# Altium schematic sheet OSCILLAR_HFB_V1p0_CAL.SchDoc
size A4; SheetNumber: 9; SheetTotal: 11; Title_: Aux Gain Stabilization Block
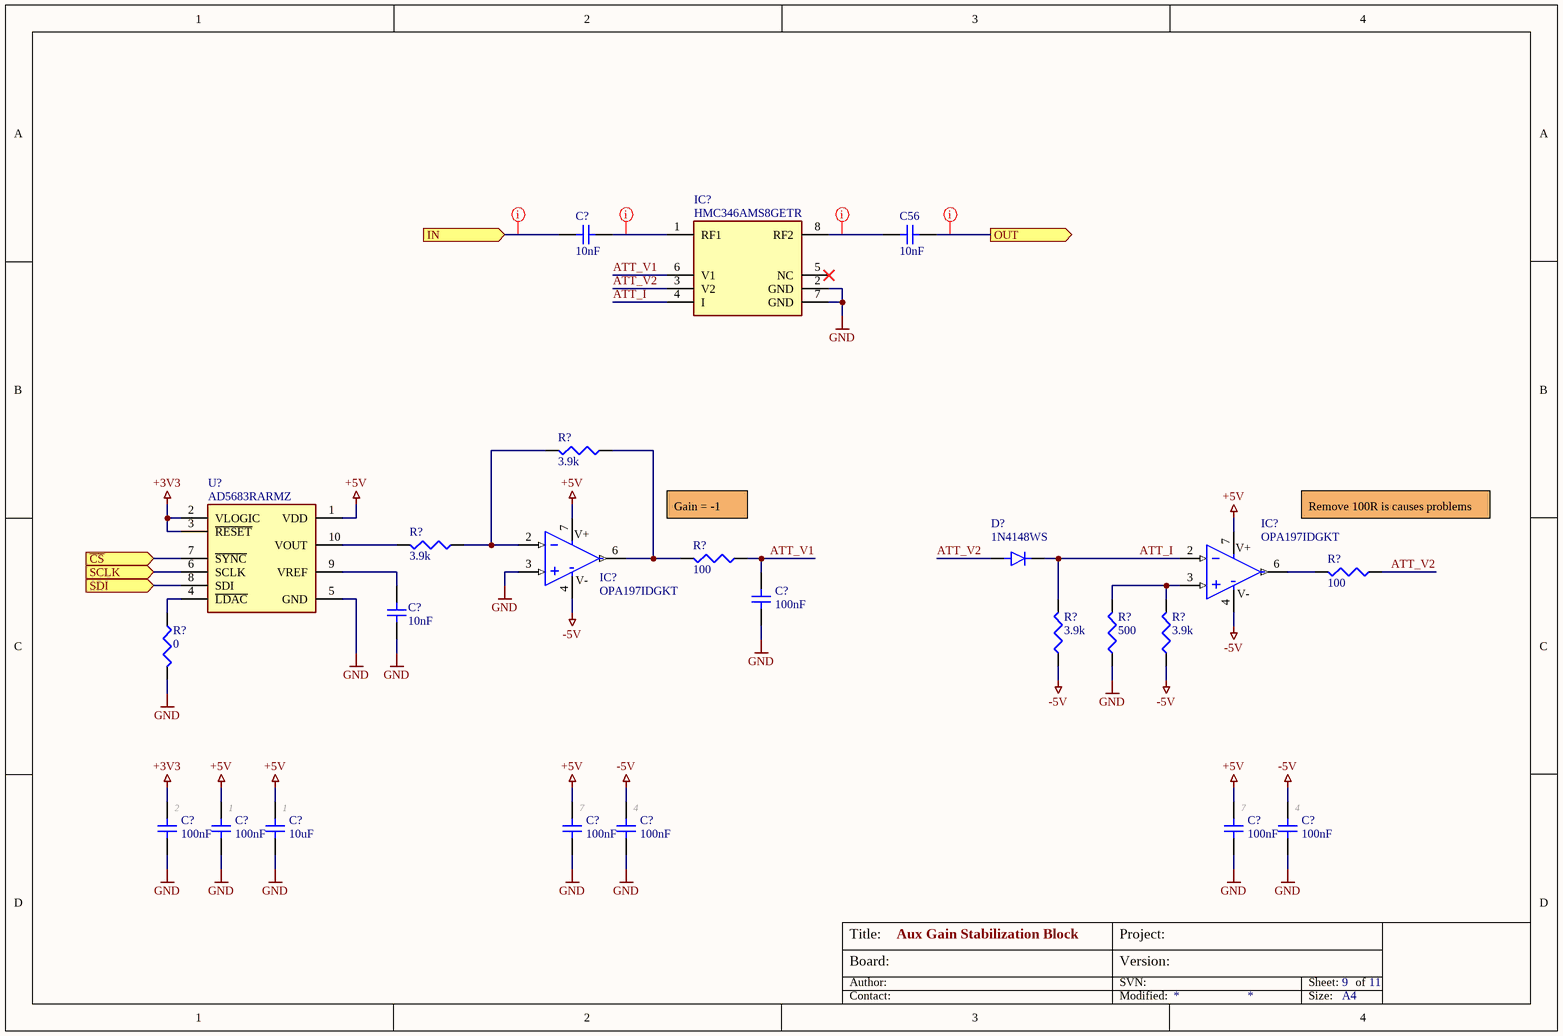
[diagram p0: OSCILLAR_HFB_V1p0_CAL.SchDoc]

## Parts
(Parts that share a designator on the sheet are numbered #1, #2 ... from top to bottom, then left to right.)
C56  10nF  [CAP_0603]
C?#1  10nF  [CAP_0603]
C?#2  100nF  [CAP-0805]
C?#3  10nF  [CAP_0603]
C?#4  100nF  [CAP-0805]
C?#5  100nF  [CAP-0805]
C?#6  10uF  [CAP_0603]
C?#7  100nF  [CAP-0805]
C?#8  100nF  [CAP-0805]
C?#9  100nF  [CAP-0805]
C?#10  100nF  [CAP-0805]
D?  1N4148WS  [SOD-323]
IC?#1  HMC346AMS8GETR  [MSOP-8_p0.65_EXP]
IC?#2  OPA197IDGKT  [VSSOP8]
IC?#3  OPA197IDGKT  [VSSOP8]
R?#1  3.9k  [RES-0603]
R?#2  3.9k  [RES-0603]
R?#3  100  [RES-0603]
R?#4  100  [RES-0603]
R?#5  3.9k  [RES-0603]
R?#6  500  [RES-0603]
R?#7  3.9k  [RES-0603]
R?#8  0  [RES-0603]
U?  AD5683RARMZ  [MSOP-10]

## Ports
IN (in, see OSCILLAR_HFB_V1p0_MAIN), OUT (out, see OSCILLAR_HFB_V1p0_MAIN), SCLK (in), SDI (in), ~{CS} (in)

## Nets
+3V3: C?#4.1 U?.2(VLOGIC) U?.3(~{RESET})
+5V: C?#5.1 C?#6.1 C?#7.1 C?#9.1 IC?#2.7(V+) IC?#3.7(V+) U?.1(VDD)
-5V: C?#8.1 C?#10.1 IC?#2.4(V-) IC?#3.4(V-) R?#5.2 R?#7.2
GND: C?#2.2 C?#3.2 C?#4.2 C?#5.2 C?#6.2 C?#7.2 C?#8.2 C?#9.2 C?#10.2 IC?#1.2(GND) IC?#1.7(GND) IC?#2.3 R?#6.2 R?#8.1 U?.5(GND)
ATT_I: D?.2 IC?#1.4(I) IC?#3.2 R?#5.1
ATT_V1: C?#2.1 IC?#1.6(V1) R?#3.2
ATT_V2: D?.1 IC?#1.3(V2) R?#4.2
~{CS}: U?.7(~{SYNC}) ; port ~{CS}
IN: C?#1.2 ; port IN
OUT: C56.1 ; port OUT
SCLK: U?.6(SCLK) ; port SCLK
SDI: U?.8(SDI) ; port SDI
NetC56_2: C56.2 IC?#1.8(RF2)
NetC?#1_1: C?#1.1 IC?#1.1(RF1)
NetC?#3_1: C?#3.1 U?.9(VREF)
NetIC?#2_2: IC?#2.2 R?#1.1 R?#2.2
NetIC?#2_6: IC?#2.6(OUT) R?#1.2 R?#3.1
NetIC?#3_3: IC?#3.3 R?#6.1 R?#7.1
NetIC?#3_6: IC?#3.6(OUT) R?#4.1
NetR?#2_1: R?#2.1 U?.10(VOUT)
NetR?#8_2: R?#8.2 U?.4(~{LDAC})

Not connected (* = marked no-connect by the designer): IC?#1 5(NC)*

## Layout directives
net class 50R: IN, NetC56_2, NetC?#1_1, OUT

## Notes on the sheet
- (near R?#3) Gain = -1
- Remove 100R is causes problems
- (near C?#4) 2
- (near C?#5) 1
- (near C?#6) 1
- (near C?#7) 7
- (near C?#8) 4
- (near C?#9) 7
- (near C?#10) 4
- Board:
- Author:
- Title:
- Project:
- SVN:
- Version:
- Sheet:
- of
- Contact:
- Modified:
- Size:
- A4

## Library data of the parts
C56 C?#1-C?#10 = NP-CAPACITOR: MLCC capacitor; Type: CAP
D? = 1N4148WS: Small Signal Diode, 75V, 150mA; Part number: 2453269; ComponentLink1Description: Datasheet; ComponentLink1URL: ONSM-S-A0013042080-1.pdf; Supplier: Farnell; ComponentLink2Description: Order; ComponentLink2URL: https://hu.farnell.com/on-semiconductor/1n4148ws/diode-small-signal-75v-sod-323f/dp/2453269?ost=2453269; Type: Diode
IC?#1 = HMC346AMS8GETR: Attenuators DC to 8 GHz, Analog voltage variable, GaAs MMIC; Part number: 584-HMC346AMS8GETR; Type: IC; Supplier: Mouser; ComponentLink1Description: Datasheet; ComponentLink1URL: hmc470A-3123262.pdf; ComponentLink2Description: Order; ComponentLink2URL: https://hu.mouser.com/ProductDetail/Analog-Devices/HMC346AMS8GETR?qs=5aG0NVq1C4wB%2Fd11tx7%252Bpw%3D%3D
IC?#2 IC?#3 = OPA197IDGKT: Precision Amplifier, 36-V, Rail-to-Rail; Part number: 595-OPA197IDGKT; Supplier: Mouser; Type: OPAMP; ComponentLink1Description: Datasheet; ComponentLink1URL: opa197.pdf; ComponentLink2Description: Order; ComponentLink2URL: https://hu.mouser.com/ProductDetail/Texas-Instruments/OPA197IDGKT?qs=sGAEpiMZZMutXGli8Ay4kO%252BXbIT%252B3d3SHv8SiZ1MpK0%3D
R?#1-R?#8 = RESISTOR: Metal Film Resistor; Type: RES
U? = AD5683RARMZ: Digital to Analogue Converter, 16 bit, 3 Wire, SPI, 2.7V to 5.5V, A grade; Part number: 4017562; Supplier: Farnell; Type: IC; ComponentLink1Description: Datasheet; ComponentLink1URL: AD5683R_5682R_5681R_5683.pdf; ComponentLink2Description: Order; ComponentLink2URL: https://hu.farnell.com/analog-devices/ad5683rarmz/dac-16bit-msop-10-40-to-105deg/dp/4017562?st=ad5683r